# EasyEDA schematic 1-Schematic_GPIO_WAVER_15PIN.json
TITLE: Sheet_1; REV: 1.0; Date: 2022-12-25; Sheet: 1/1; Drawn By: maarnotto; Company: Your Company
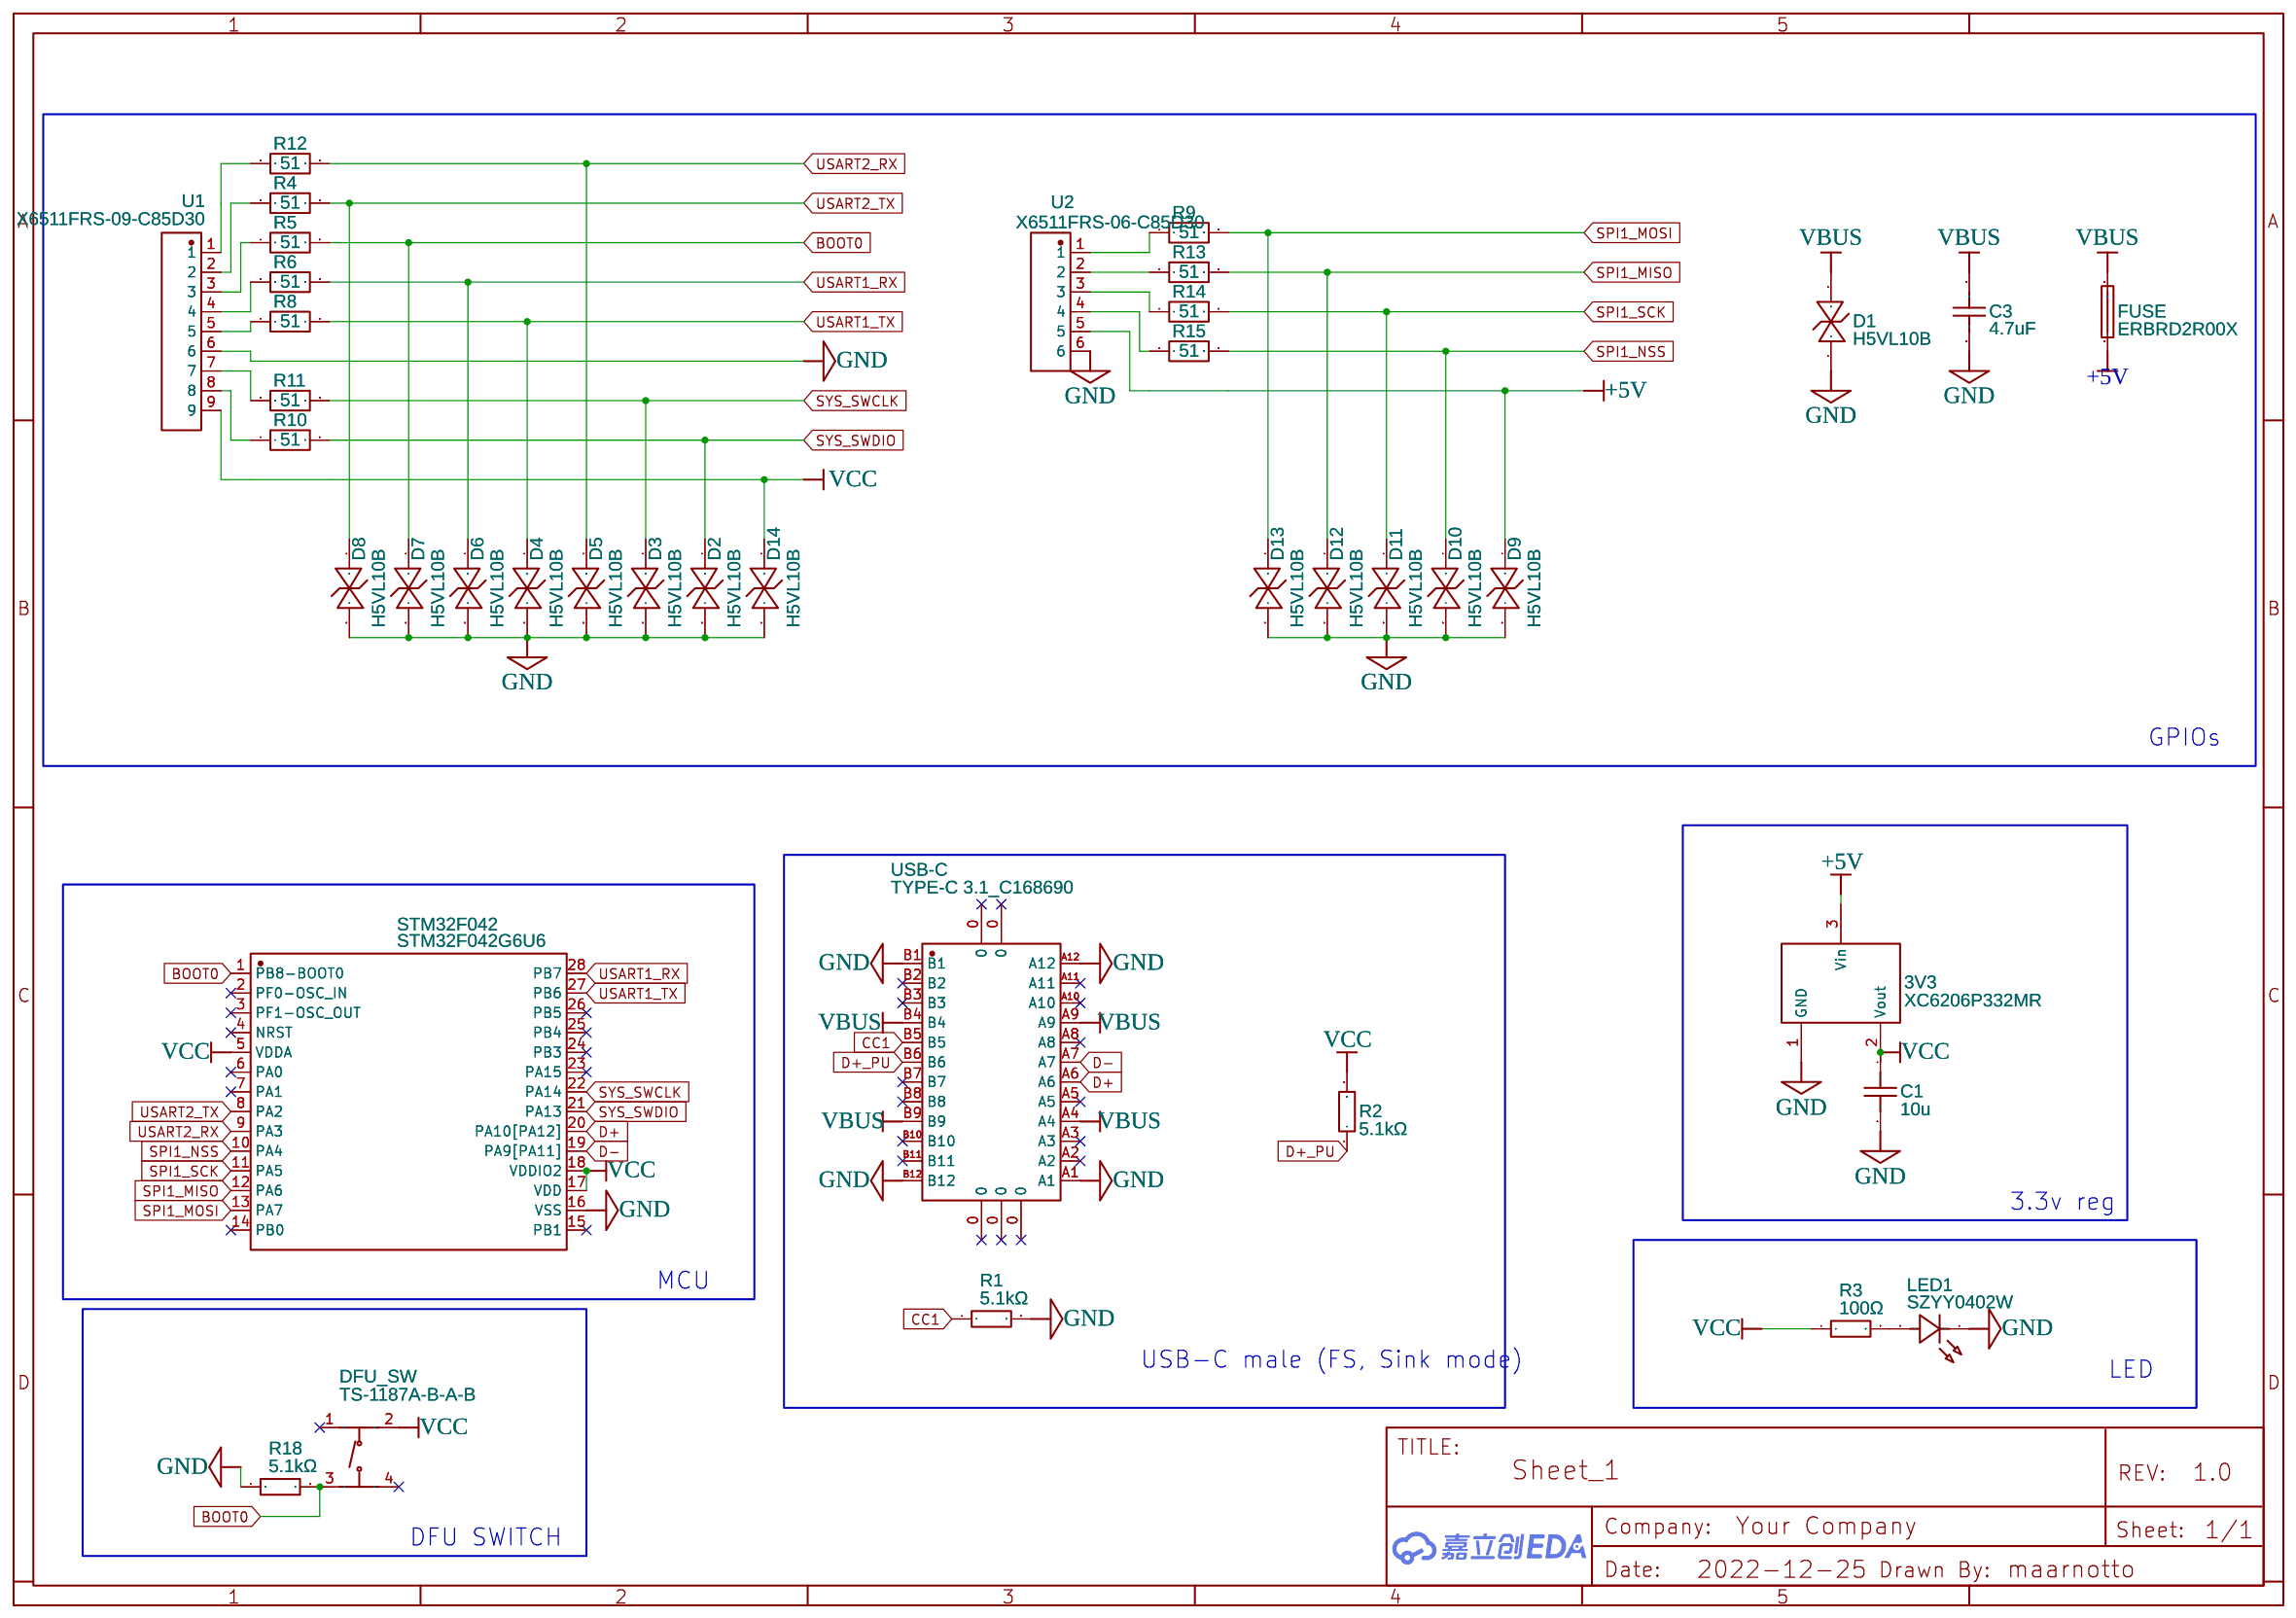
[diagram p0: schematic sheet]

## Parts
3V3  XC6206P332MR  [SOT-23-3_L2.9-W1.6-P1.90-LS2.8-BR]
C1  10u  [C0603]
C3  4.7uF  [C0603]
D1  H5VL10B  [SOD-882_L1.0-W0.6-BI]
D2  H5VL10B  [SOD-882_L1.0-W0.6-BI]
D3  H5VL10B  [SOD-882_L1.0-W0.6-BI]
D4  H5VL10B  [SOD-882_L1.0-W0.6-BI]
D5  H5VL10B  [SOD-882_L1.0-W0.6-BI]
D6  H5VL10B  [SOD-882_L1.0-W0.6-BI]
D7  H5VL10B  [SOD-882_L1.0-W0.6-BI]
D8  H5VL10B  [SOD-882_L1.0-W0.6-BI]
D9  H5VL10B  [SOD-882_L1.0-W0.6-BI]
D10  H5VL10B  [SOD-882_L1.0-W0.6-BI]
D11  H5VL10B  [SOD-882_L1.0-W0.6-BI]
D12  H5VL10B  [SOD-882_L1.0-W0.6-BI]
D13  H5VL10B  [SOD-882_L1.0-W0.6-BI]
D14  H5VL10B  [SOD-882_L1.0-W0.6-BI]
DFU_SW  TS-1187A-B-A-B  [SW-SMD_4P-L5.1-W5.1-P3.70-LS6.5-TL-2]
FUSE  ERBRD2R00X  [F0402]
LED1  SZYY0402W  [LED0402-RD_WHITE]
R1  5.1kΩ  [R0402]
R2  5.1kΩ  [R0402]
R3  100Ω  [R0402]
R4  51  [R0402]
R5  51  [R0402]
R6  51  [R0402]
R8  51  [R0402]
R9  51  [R0402]
R10  51  [R0402]
R11  51  [R0402]
R12  51  [R0402]
R13  51  [R0402]
R14  51  [R0402]
R15  51  [R0402]
R18  5.1kΩ  [R0402]
STM32F042  STM32F042G6U6  [UFQFPN-28_L4.0-W4.0-P0.50-BL]
U1  X6511FRS-09-C85D30  [HDR-SMD_9P-P2.54-H-F-L11.5]
U2  X6511FRS-06-C85D30  [HDR-SMD_6P-P2.54-H-F-L11.5]
USB-C  TYPE-C 3.1_C168690  [USB-C-SMD_TYPE-C-USB-3]

## Library data of the parts
3V3 = XC6206P332MR: Supplier: LCSC; Manufacturer: TOREX(特瑞仕); Supplier Part: C5446; JLCPCB Part Class: Basic Part
C1 C3 = C_0603_US: Contributor: LCEDA_Lib
D1-D14 = H5VL10B: Supplier: LCSC; Supplier Part: C7420372; Manufacturer: 宏迦橙; Contributor: lcsc; JLCPCB Part Class: Extended Part
DFU_SW = TS-1187A-B-A-B: Supplier: LCSC; Supplier Part: C318884; Manufacturer: XKB Connectivity(中国星坤); Contributor: LCSC; JLCPCB Part Class: Basic Part
FUSE = ERBRD2R00X: Contributor: LCSC; Supplier: LCSC; Supplier Part: C424348; Manufacturer: PANASONIC(松下); JLCPCB Part Class: Extended Part
LED1 = SZYY0402W: Contributor: lcsc; Supplier: LCSC; Supplier Part: C434448; Manufacturer: yongyu(永裕光电); JLCPCB Part Class: Extended Part
R1 R2 R18 = 0402WGF5101TCE: Supplier: LCSC; Manufacturer: UNI-ROYAL(厚声); Supplier Part: C25905; JLCPCB Part Class: Basic Part
R3 = 0402WGF1000TCE: Supplier: LCSC; Manufacturer: UNI-ROYAL(厚声); Supplier Part: C25076; JLCPCB Part Class: Basic Part
R4-R6 R8-R15 = R_0603_EU: Contributor: LCEDA_Lib
STM32F042 = STM32F042G6U6: Contributor: LCSC; Supplier: LCSC; Supplier Part: C961597; Manufacturer: ST(意法半导体); JLCPCB Part Class: Extended Part
U1 = X6511FRS-09-C85D30: Contributor: lcsc; Supplier: LCSC; Supplier Part: C5142242; Manufacturer: XKB Connectivity(中国星坤); JLCPCB Part Class: Extended Part
U2 = X6511FRS-06-C85D30: Contributor: lcsc; Supplier: LCSC; Supplier Part: C5142239; Manufacturer: XKB Connectivity(中国星坤); JLCPCB Part Class: Extended Part
USB-C = TYPE-C 3.1_C168690: Contributor: 立创EDA官方封装库; Supplier: LCSC; Supplier Part: C168690; Manufacturer: 精拓金; Manufacturer Part: 918-118A2021Y40000; JLCPCB Part Class: Extended Part

## Nets
+5V: 3V3.3(Vin) D9.1(C) FUSE.1 U2.5
GND: 3V3.1(GND) C1.2 C3.1 D1.2(A) D2.2(A) D3.2(A) D4.2(A) D5.2(A) D6.2(A) D7.2(A) D8.2(A) D9.2(A) D10.2(A) D11.2(A) D12.2(A) D13.2(A) D14.2(A) LED1.1(K) R1.2 R18.1 STM32F042.16(VSS) U1.6 U2.6 USB-C.A1 USB-C.A12 USB-C.B1 USB-C.B12
VBUS: C3.2 D1.1(C) FUSE.2 USB-C.A4 USB-C.A9 USB-C.B4 USB-C.B9
VCC: 3V3.2(Vout) C1.1 D14.1(C) DFU_SW.2(B) R2.2 R3.1 STM32F042.5(VDDA) STM32F042.17(VDD) STM32F042.18(VDDIO2) U1.9
BOOT0: D7.1(C) DFU_SW.3(C) R5.2 R18.2 STM32F042.1(PB8-BOOT0)
CC1: R1.1 USB-C.B5
D+: STM32F042.20(PA10[PA12]) USB-C.A6
D+_PU: R2.1 USB-C.B6
D-: STM32F042.19(PA9[PA11]) USB-C.A7
SPI1_MISO: D12.1(C) R13.2 STM32F042.12(PA6)
SPI1_MOSI: D13.1(C) R9.2 STM32F042.13(PA7)
SPI1_NSS: D10.1(C) R15.2 STM32F042.10(PA4)
SPI1_SCK: D11.1(C) R14.2 STM32F042.11(PA5)
SYS_SWCLK: D3.1(C) R11.2 STM32F042.22(PA14)
SYS_SWDIO: D2.1(C) R10.2 STM32F042.21(PA13)
USART1_RX: D6.1(C) R6.2 STM32F042.28(PB7)
USART1_TX: D4.1(C) R8.2 STM32F042.27(PB6)
USART2_RX: D5.1(C) R12.2 STM32F042.9(PA3)
USART2_TX: D8.1(C) R4.2 STM32F042.8(PA2)
Net-(LED1-2): LED1.2(A) R3.2
Net-(R4-1): R4.1 U1.2
Net-(R5-1): R5.1 U1.3
Net-(R6-1): R6.1 U1.4
Net-(R8-1): R8.1 U1.5
Net-(R9-1): R9.1 U2.1
Net-(R10-1): R10.1 U1.8
Net-(R11-1): R11.1 U1.7
Net-(R12-1): R12.1 U1.1
Net-(R13-1): R13.1 U2.2
Net-(R14-1): R14.1 U2.3
Net-(R15-1): R15.1 U2.4

Not connected (* = marked no-connect by the designer): DFU_SW 1(A)* 4(D)*; STM32F042 2(PF0-OSC_IN)* 3(PF1-OSC_OUT)* 4(NRST)* 6(PA0)* 7(PA1)* 14(PB0)* 15(PB1)* 23(PA15)* 24(PB3)* 25(PB4)* 26(PB5)*; USB-C 0* A2* A3* A5* A8* A10* A11* B2* B3* B7* B8* B10* B11*

## Notes on the sheet
- GPIOs
- 3.3v reg
- MCU
- USB-C male (FS, Sink mode)
- LED
- DFU SWITCH
